# EAGLE schematic fermentasi (EAGLE 7.1.0)
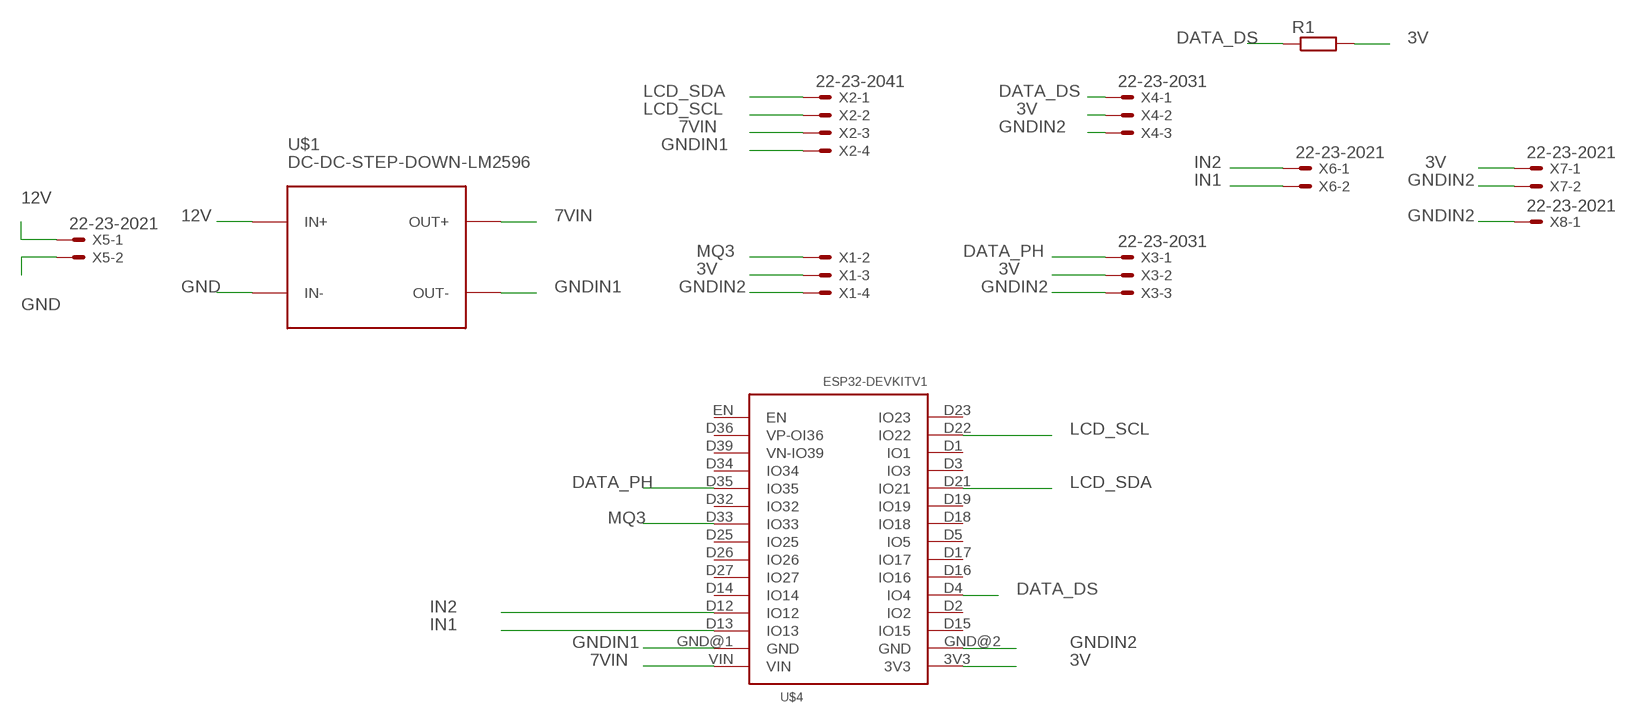
[diagram p0: schematic, sheet 1]

## Parts
R1  R-EU_0207/10  [0207/10]
U$1  DC-DC-STEP-DOWN-LM2596  [DC-DC-STEP-DOWN-LM2596]
U$4  ESP32DEVKITV1  [ESP32-DEVKITV1]
X1  22-23-2041  [22-23-2041]
X2  22-23-2041  [22-23-2041]
X3  22-23-2031  [22-23-2031]
X4  22-23-2031  [22-23-2031]
X5  22-23-2021  [22-23-2021]
X6  22-23-2021  [22-23-2021]
X7  22-23-2021  [22-23-2021]
X8  22-23-2021  [22-23-2021]

## Nets
3V: R1.2 U$4.3V3 X1.3 X3.2 X4.2 X7.1
7VIN: U$1.OUT+ U$4.VIN X2.3
12V: U$1.IN+ X5.1
DATA_DS: R1.1 U$4.D4(IO4) X4.1
DATA_PH: U$4.D35(IO35) X3.1
GND: U$1.IN- X5.2
GNDIN1: U$1.OUT- U$4.GND@1(GND) X2.4
GNDIN2: U$4.GND@2(GND) X1.4 X3.3 X4.3 X7.2 X8.1
IN1: U$4.D13(IO13) X6.2
IN2: U$4.D12(IO12) X6.1
LCD_SCL: U$4.D22(IO22) X2.2
LCD_SDA: U$4.D21(IO21) X2.1
MQ3: U$4.D33(IO33) X1.2
Unconnected: U$4.D1(IO1) U$4.D2(IO2) U$4.D3(IO3) U$4.D5(IO5) U$4.D14(IO14) U$4.D15(IO15) U$4.D16(IO16) U$4.D17(IO17) U$4.D18(IO18) U$4.D19(IO19) U$4.D23(IO23) U$4.D25(IO25) U$4.D26(IO26) U$4.D27(IO27) U$4.D32(IO32) U$4.D34(IO34) U$4.D36(VP-OI36) U$4.D39(VN-IO39) U$4.EN X1.1 X8.2

## Library data of the parts
R1 = rcl:R-EU_: RESISTOR, European symbol
U$1 = diy-modules (2):DC-DC-STEP-DOWN-LM2596: DC/DC Step-Down Regulator based on LM2596-ADJ chip LM2596 datasheet available here: http://www.ti.com/lit/ds/symlink/lm2596.pdf Click here to find device on ebay.com <http://www.ebay.com/sch/lm2596+power+regulator>
U$4 = ESP32-DEVKITV1:ESP32DEVKITV1
X1 X2 = con-molex:22-23-2041: .100" (2.54mm) Center Header - 4 Pin; MF: MOLEX; MPN: 22-23-2041; OC_FARNELL: 1462920; OC_NEWARK: 38C0355
X3 X4 = con-molex:22-23-2031: .100" (2.54mm) Center Header - 3 Pin; MF: MOLEX; MPN: 22-23-2031; OC_FARNELL: 1462950; OC_NEWARK: 30C0862
X5-X8 = con-molex:22-23-2021: .100" (2.54mm) Center Header - 2 Pin; MF: MOLEX; MPN: 22-23-2021; OC_FARNELL: 1462926; OC_NEWARK: 25C3832